# Altium schematic sheet curr-mon-INA214-Q1.SchDoc
size A4; DrawnBy: J. Reimer, D. Vogel; Revision: 1.0
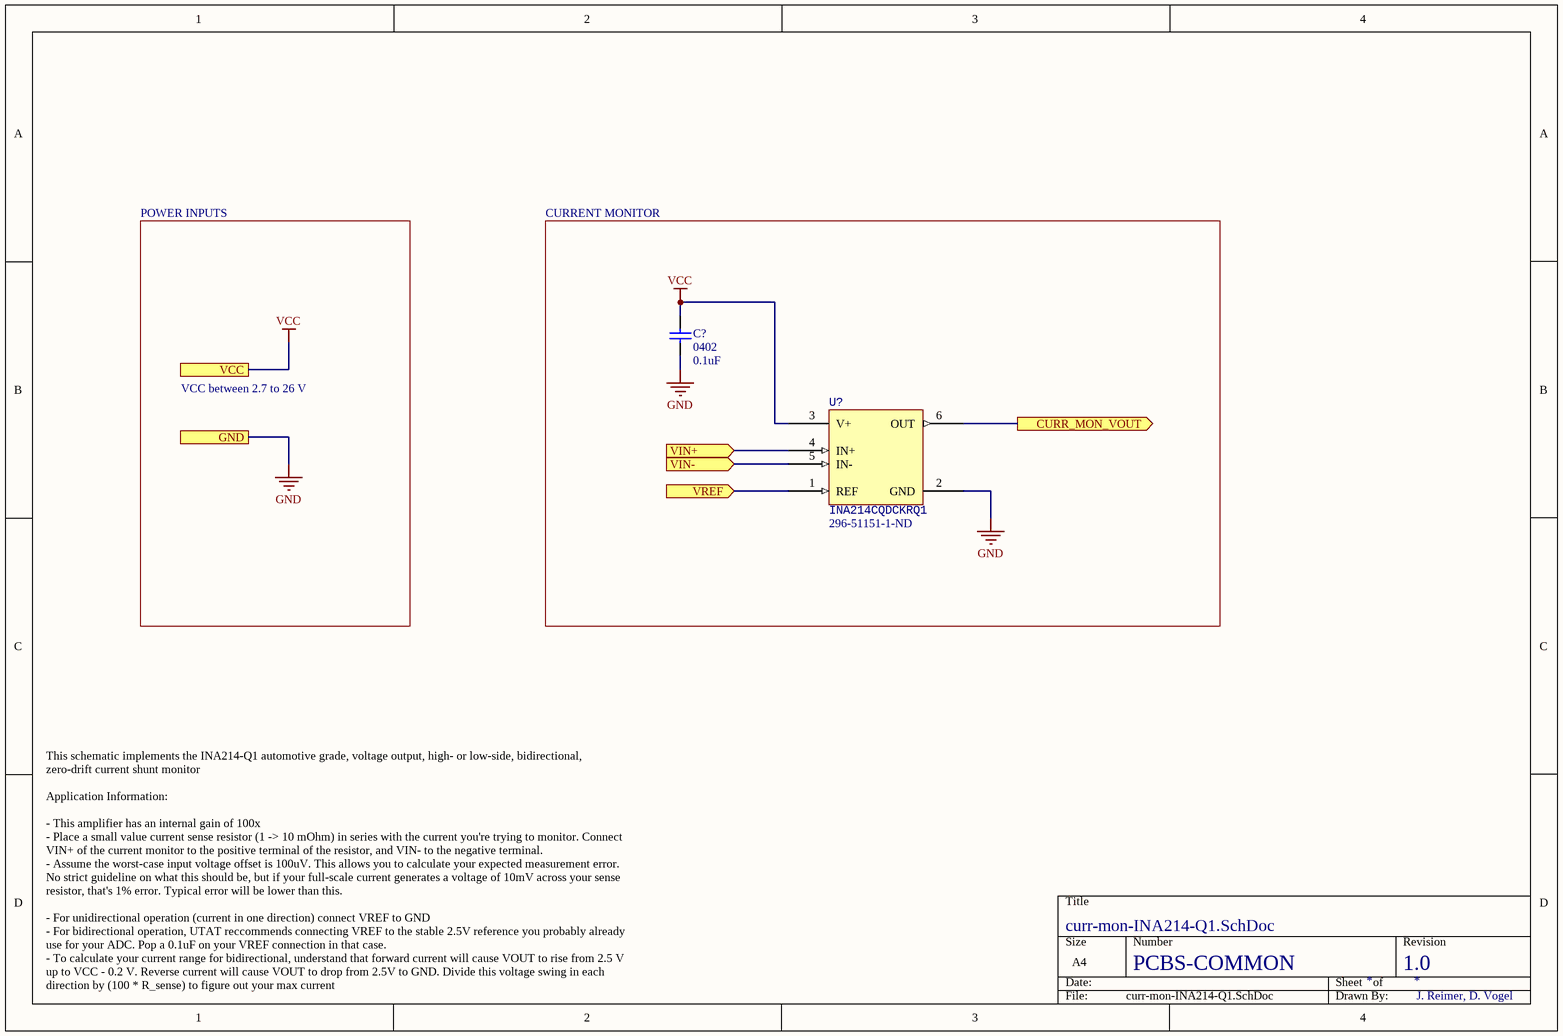
[diagram p0: curr-mon-INA214-Q1.SchDoc]

## Parts
C?  0402  value 0.1uF  [CAP0402R]
U?  INA214CQDCKRQ1  Supplier Part Number 1: 296-51151-1-ND  [TI-SOT-SC70 (DCK)]

## Blocks framed on the sheet
CURRENT MONITOR: C? U?

## Ports
CURR_MON_VOUT (out), GND, VCC, VIN+ (in), VIN- (in), VREF (in)

## Nets
GND: C?.1 U?.2(GND) ; port GND
VCC: C?.2 U?.3(V+) ; port VCC
CURR_MON_VOUT: U?.6(OUT) ; port CURR_MON_VOUT
VIN+: U?.4(IN+) ; port VIN+
VIN-: U?.5(IN-) ; port VIN-
VREF: U?.1(REF) ; port VREF

## Notes on the sheet
- POWER INPUTS
- VCC between 2.7 to 26 V
- This schematic implements the INA214-Q1 automotive grade, voltage output, high- or low-side, bidirectional, zero-drift current shunt monitor
  Application Information:
  - This amplifier has an internal gain of 100x
  - Place a small value current sense resistor (1 -> 10 mOhm) in series with the current you're trying to monitor. Connect VIN+ of the current monitor to the positive terminal of the resistor, and VIN- to the negative terminal.
  - Assume the worst-case input voltage offset is 100uV. This allows you to calculate your expected measurement error. No strict guideline on what this should be, but if your full-scale current generates a voltage of 10mV across your sense resistor, that's 1% error. Typical error will be lower than this.
  - For unidirectional operation (current in one direction) connect VREF to GND
  - For bidirectional operation, UTAT reccommends connecting VREF to the stable 2.5V reference you probably already use for your ADC. Pop a 0.1uF on your VREF connection in that case.
  - To calculate your current range for bidirectional, understand that forward current will cause VOUT to rise from 2.5 V up to VCC - 0.2 V. Reverse current will cause VOUT to drop from 2.5V to GND. Divide this voltage swing in each direction by (100 * R_sense) to figure out your max current
- PCBS-COMMON

## Library data of the parts
C? = CAP0402: 0402 capacitor; Manufacturer: Taiyo Yuden; Manufacturer Part Number: EMK105B7104KVHF; Description: Multilayer Ceramic Capacitors MLCC - SMD/SMT 0.1uF 16V X7R +/-10% 0402 AEC-Q200; Voltage Rating: 16V; Capacitance: 100nF; Tolerance: 10%; Dielectric: X7R; Supplier 1: Digi-Key; Supplier Part Number 1: 587-3807-1-ND; Stock 1: 17496; Pricing 1: 1=0.1, 10=0.057, 100=0.0254, 500=0.01812, 1000=0.01423, 2500=0.01294, 5000=0.0119 (USD); Mount: Surface Mount; Case/Package: 0402; Weight: 2.3E-05oz; Case Code (Metric): 1005; Case Code (Imperial): 0402; Min Operating Temperature: -55°C; Max Operating Temperature: 125°C; Package Quantity: 10000; Packaging: Tape and Reel; Termination: SMD/SMT; Voltage Rating (DC): 16V; Length: 0.039inch; Height: 0.5mm; Width: 0.02inch; Thickness: 0.022inch; Ratings: AEC-Q200; Lead Free: Lead Free; Halogen Free: Halogen Free
U? = INA214CQDCKRQ1: IC CURR SENSE 1 CIRCUIT SC70-6; Supplier 1: Digi-Key; ComponentLink1Description: Datasheet; ComponentLink1URL: http://www.ti.com/general/docs/suppproductinfo.tsp?distId=10&gotoUrl=http%3A%2F%2Fwww.ti.com%2Flit%2Fgpn%2Fina213-q1